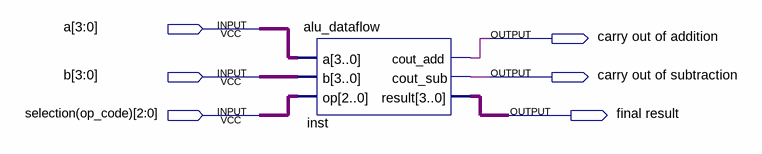
[diagram p0: schematic sheet]
// Quartus schematic block_diagram_alu.bdf as structural Verilog: 1 symbols, 6 pins
module block_diagram_alu (
  input  [3:0] a,
  input  [3:0] b,
  input  [2:0] \selection(op_code) ,
  output \carry_out_of_addition ,
  output \carry_out_of_subtraction ,
  output \final_result 
);

  wire [3:0] inst_result;

  alu_dataflow inst (
    .a(a), .b(b), .op(\selection(op_code) ), .cout_add(\carry_out_of_addition ),
    .cout_sub(\carry_out_of_subtraction ), .result(inst_result));
endmodule
